# Altium schematic sheet BPF_Block.SchDoc
size A4
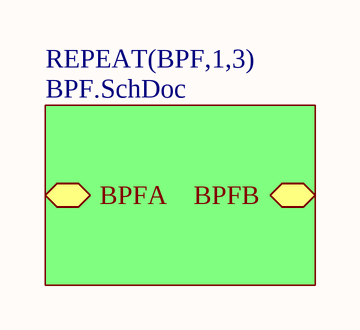
[diagram p0: BPF_Block.SchDoc]

## Sub-sheets
REPEAT(BPF,1,3) = BPF.SchDoc: BPFA, BPFB